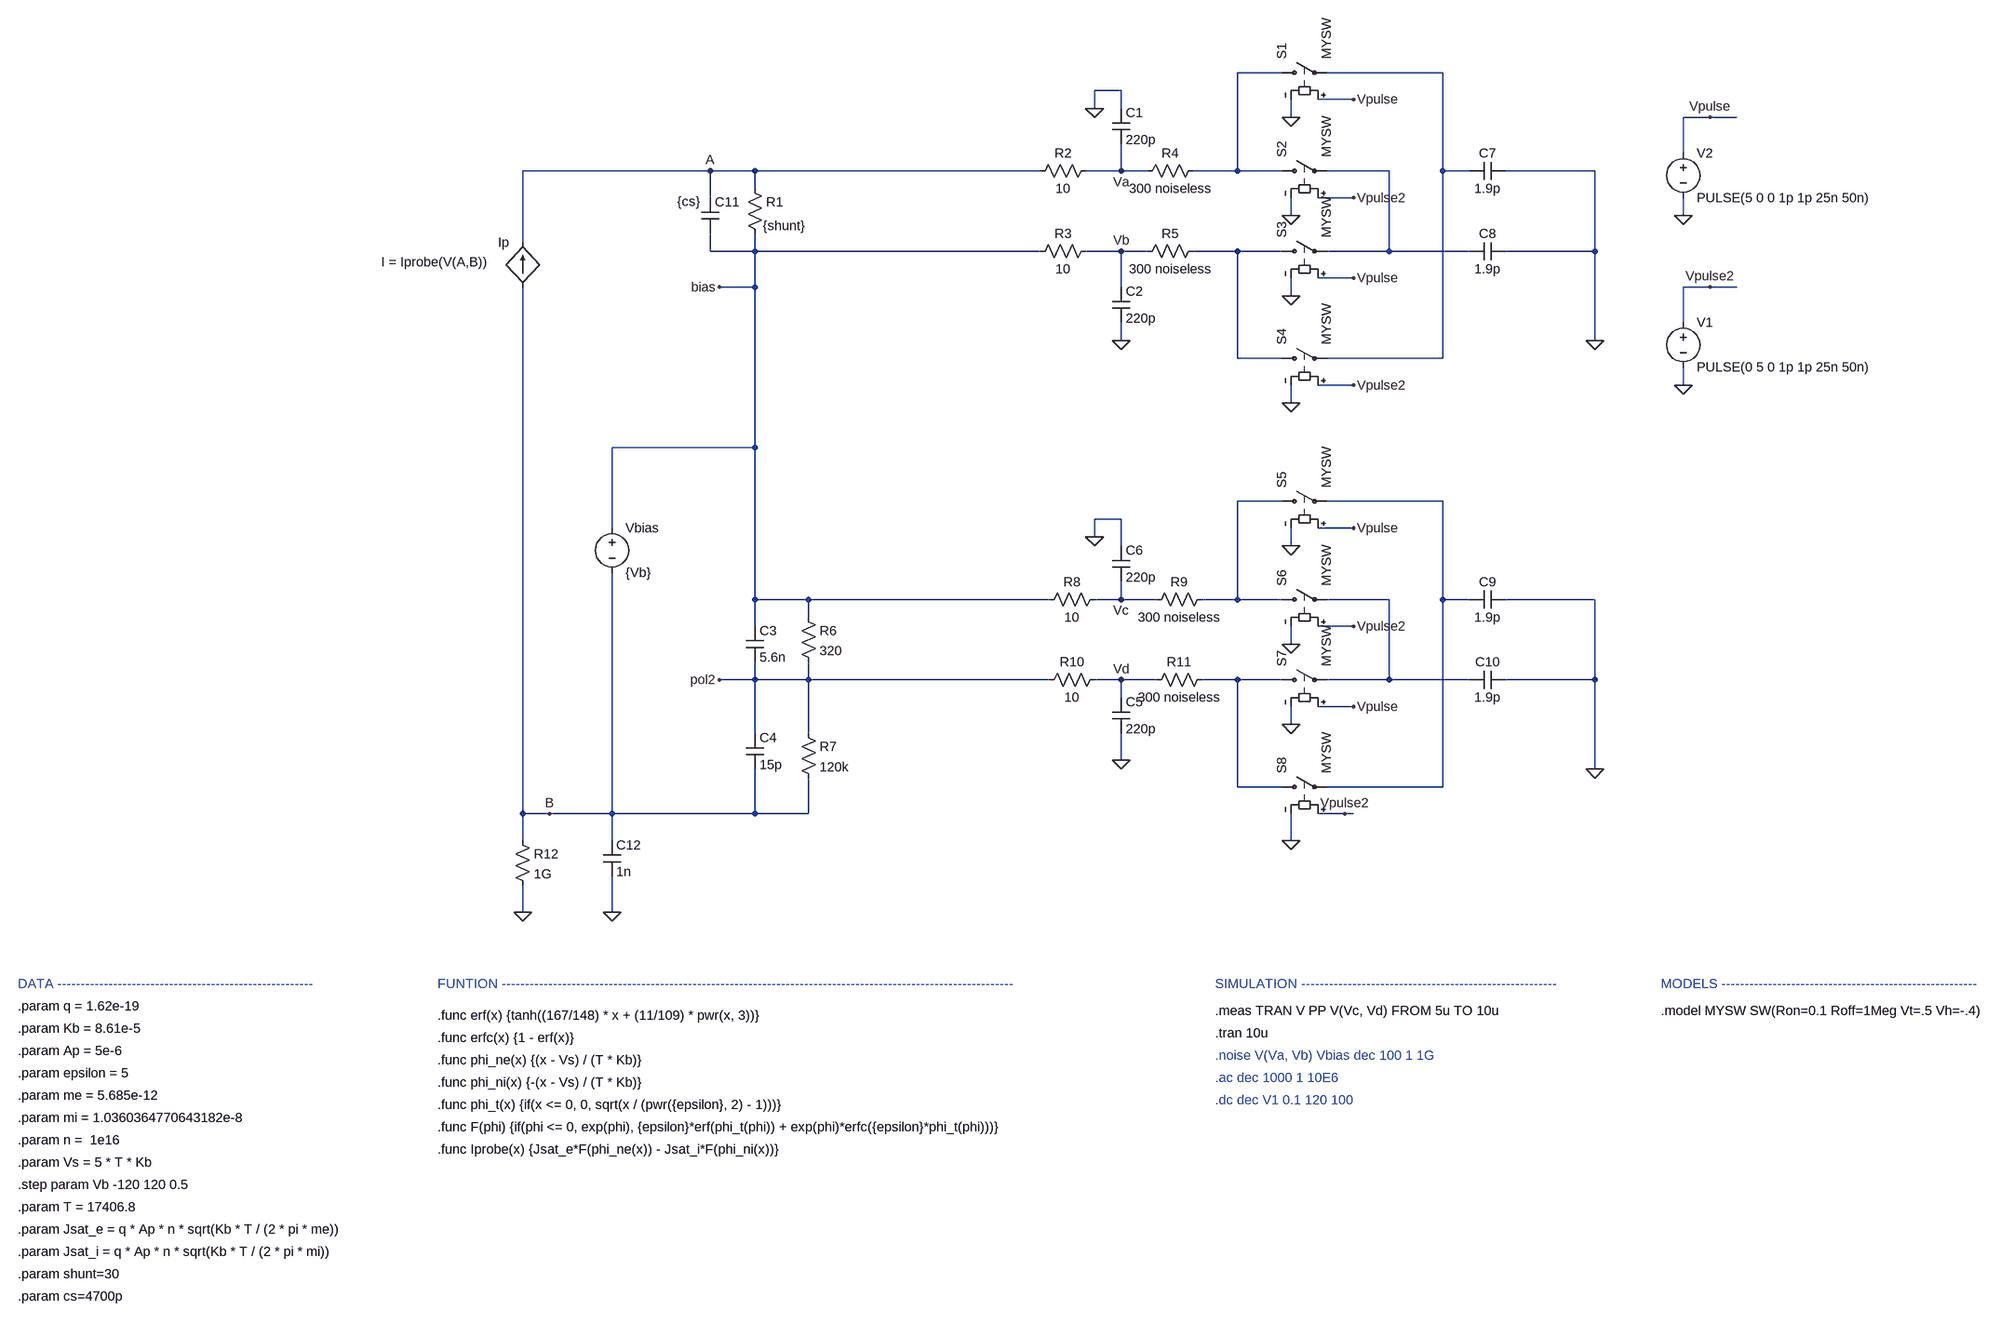
[diagram p0: schematic 3-single_probe.asc]
3-single_probe.asc, the LTspice schematic file:
Version 4.1
SHEET 1 2816 2476
WIRE 864 -304 784 -304
WIRE 1152 -304 944 -304
WIRE 576 -272 528 -272
WIRE 992 -256 928 -256
WIRE 528 -240 528 -272
WIRE 576 -240 576 -272
WIRE 880 -224 880 -256
WIRE 1712 -224 1664 -224
WIRE 1760 -224 1712 -224
WIRE 1664 -160 1664 -224
WIRE -160 -128 -496 -128
WIRE -80 -128 -160 -128
WIRE 432 -128 -80 -128
WIRE 576 -128 576 -176
WIRE 576 -128 512 -128
WIRE 624 -128 576 -128
WIRE 784 -128 784 -304
WIRE 784 -128 704 -128
WIRE 864 -128 784 -128
WIRE 1056 -128 944 -128
WIRE 1152 -128 1152 -304
WIRE 1200 -128 1152 -128
WIRE 1424 -128 1264 -128
WIRE -80 -96 -80 -128
WIRE -160 -80 -160 -128
WIRE 992 -80 928 -80
WIRE 880 -48 880 -80
WIRE 1664 -48 1664 -80
WIRE -496 0 -496 -128
WIRE -160 16 -160 -16
WIRE -80 16 -80 -16
WIRE -80 16 -160 16
WIRE 432 16 -80 16
WIRE 576 16 512 16
WIRE 624 16 576 16
WIRE 784 16 704 16
WIRE 864 16 784 16
WIRE 1056 16 1056 -128
WIRE 1056 16 944 16
WIRE 1200 16 1056 16
WIRE 1424 16 1424 -128
WIRE 1424 16 1264 16
WIRE 992 64 928 64
WIRE -80 80 -80 16
WIRE -80 80 -144 80
WIRE 576 80 576 16
WIRE 1712 80 1664 80
WIRE 1760 80 1712 80
WIRE 880 96 880 64
WIRE 1664 144 1664 80
WIRE 576 176 576 144
WIRE 1424 176 1424 16
WIRE 784 208 784 16
WIRE 864 208 784 208
WIRE 1152 208 1152 -128
WIRE 1152 208 944 208
WIRE 992 256 928 256
WIRE 1664 256 1664 224
WIRE 880 288 880 256
WIRE -80 368 -80 80
WIRE -80 368 -336 368
WIRE 864 464 784 464
WIRE 1152 464 944 464
WIRE 576 496 528 496
WIRE -336 512 -336 368
WIRE 992 512 928 512
WIRE 528 528 528 496
WIRE 576 544 576 496
WIRE 880 544 880 512
WIRE -80 640 -80 368
WIRE 16 640 -80 640
WIRE 448 640 16 640
WIRE 576 640 576 608
WIRE 576 640 528 640
WIRE 640 640 576 640
WIRE 784 640 784 464
WIRE 784 640 720 640
WIRE 864 640 784 640
WIRE 1056 640 944 640
WIRE 1152 640 1152 464
WIRE 1200 640 1152 640
WIRE 1424 640 1264 640
WIRE 16 672 16 640
WIRE -80 688 -80 640
WIRE 992 688 928 688
WIRE 880 720 880 688
WIRE -80 784 -80 752
WIRE -80 784 -144 784
WIRE 16 784 16 752
WIRE 16 784 -80 784
WIRE 448 784 16 784
WIRE 576 784 528 784
WIRE 640 784 576 784
WIRE 784 784 720 784
WIRE 864 784 784 784
WIRE 1056 784 1056 640
WIRE 1056 784 944 784
WIRE 1200 784 1056 784
WIRE 1424 784 1424 640
WIRE 1424 784 1264 784
WIRE 576 816 576 784
WIRE 992 832 928 832
WIRE 880 864 880 832
WIRE -80 880 -80 784
WIRE 16 880 16 784
WIRE 576 928 576 880
WIRE 1424 944 1424 784
WIRE 784 976 784 784
WIRE 864 976 784 976
WIRE 1152 976 1152 640
WIRE 1152 976 944 976
WIRE -496 1024 -496 80
WIRE -448 1024 -496 1024
WIRE -336 1024 -336 592
WIRE -336 1024 -448 1024
WIRE -80 1024 -80 944
WIRE -80 1024 -336 1024
WIRE 16 1024 16 960
WIRE 16 1024 -80 1024
WIRE 976 1024 928 1024
WIRE 992 1024 976 1024
WIRE -496 1072 -496 1024
WIRE -336 1072 -336 1024
WIRE 880 1072 880 1024
WIRE -496 1200 -496 1152
WIRE -336 1200 -336 1136
FLAG 576 176 0
FLAG 528 -240 0
FLAG 576 -128 Va
FLAG 576 16 Vb
FLAG -144 80 bias
FLAG 528 528 0
FLAG 576 928 0
FLAG 576 640 Vc
FLAG 576 784 Vd
FLAG 1424 176 0
FLAG 992 -256 Vpulse
FLAG 992 64 Vpulse
FLAG 880 -224 0
FLAG 880 96 0
FLAG 1424 944 0
FLAG 992 512 Vpulse
FLAG 992 832 Vpulse
FLAG 880 544 0
FLAG 880 864 0
FLAG 880 720 0
FLAG 880 1072 0
FLAG 880 -48 0
FLAG 880 288 0
FLAG 976 1024 Vpulse2
FLAG 992 688 Vpulse2
FLAG 992 -80 Vpulse2
FLAG 992 256 Vpulse2
FLAG 1664 -48 0
FLAG 1664 256 0
FLAG 1712 -224 Vpulse
FLAG 1712 80 Vpulse2
FLAG -144 784 pol2
FLAG -336 1200 0
FLAG -160 -128 A
FLAG -448 1024 B
FLAG -496 1200 0
SYMBOL res -96 -112 R0
WINDOW 3 30 82 Left 2
SYMATTR Value {shunt}
SYMATTR InstName R1
SYMBOL res 528 -144 R90
WINDOW 0 0 56 VBottom 2
WINDOW 3 32 56 VTop 2
SYMATTR InstName R2
SYMATTR Value 10
SYMBOL res 416 32 R270
WINDOW 0 32 56 VTop 2
WINDOW 3 0 56 VBottom 2
SYMATTR InstName R3
SYMATTR Value 10
SYMBOL res 608 -112 R270
WINDOW 0 32 56 VTop 2
WINDOW 3 0 56 VBottom 2
SYMATTR InstName R4
SYMATTR Value 300 noiseless
SYMBOL res 608 32 R270
WINDOW 0 32 56 VTop 2
WINDOW 3 0 56 VBottom 2
SYMATTR InstName R5
SYMATTR Value 300 noiseless
SYMBOL cap 560 -240 R0
SYMATTR InstName C1
SYMATTR Value 220p
SYMBOL cap 560 80 R0
SYMATTR InstName C2
SYMATTR Value 220p
SYMBOL res 0 656 R0
SYMATTR InstName R6
SYMATTR Value 320
SYMBOL res 0 864 R0
SYMATTR InstName R7
SYMATTR Value 120k
SYMBOL cap -96 688 R0
SYMATTR InstName C3
SYMATTR Value 5.6n
SYMBOL cap -96 880 R0
SYMATTR InstName C4
SYMATTR Value 15p
SYMBOL res 544 624 R90
WINDOW 0 0 56 VBottom 2
WINDOW 3 32 56 VTop 2
SYMATTR InstName R8
SYMATTR Value 10
SYMBOL res 736 624 R90
WINDOW 0 0 56 VBottom 2
WINDOW 3 32 56 VTop 2
SYMATTR InstName R9
SYMATTR Value 300 noiseless
SYMBOL res 544 768 R90
WINDOW 0 0 56 VBottom 2
WINDOW 3 32 56 VTop 2
SYMATTR InstName R10
SYMATTR Value 10
SYMBOL res 736 768 R90
WINDOW 0 0 56 VBottom 2
WINDOW 3 32 56 VTop 2
SYMATTR InstName R11
SYMATTR Value 300 noiseless
SYMBOL cap 560 816 R0
SYMATTR InstName C5
SYMATTR Value 220p
SYMBOL cap 560 544 R0
SYMATTR InstName C6
SYMATTR Value 220p
SYMBOL sw 848 -304 R270
SYMATTR InstName S1
SYMATTR Value MYSW
SYMBOL sw 848 -128 R270
SYMATTR InstName S2
SYMATTR Value MYSW
SYMBOL sw 848 16 R270
SYMATTR InstName S3
SYMATTR Value MYSW
SYMBOL sw 848 208 R270
SYMATTR InstName S4
SYMATTR Value MYSW
SYMBOL voltage 1664 128 R0
WINDOW 123 0 0 Left 0
WINDOW 39 0 0 Left 0
SYMATTR InstName V1
SYMATTR Value PULSE(0 5 0 1p 1p 25n 50n)
SYMBOL cap 1264 -144 R90
WINDOW 0 0 32 VBottom 2
WINDOW 3 32 32 VTop 2
SYMATTR InstName C7
SYMATTR Value 1.9p
SYMBOL cap 1264 0 R90
WINDOW 0 0 32 VBottom 2
WINDOW 3 32 32 VTop 2
SYMATTR InstName C8
SYMATTR Value 1.9p
SYMBOL sw 848 464 R270
SYMATTR InstName S5
SYMATTR Value MYSW
SYMBOL sw 848 640 R270
SYMATTR InstName S6
SYMATTR Value MYSW
SYMBOL sw 848 784 R270
SYMATTR InstName S7
SYMATTR Value MYSW
SYMBOL sw 848 976 R270
SYMATTR InstName S8
SYMATTR Value MYSW
SYMBOL cap 1264 624 R90
WINDOW 0 0 32 VBottom 2
WINDOW 3 32 32 VTop 2
SYMATTR InstName C9
SYMATTR Value 1.9p
SYMBOL cap 1264 768 R90
WINDOW 0 0 32 VBottom 2
WINDOW 3 32 32 VTop 2
SYMATTR InstName C10
SYMATTR Value 1.9p
SYMBOL voltage 1664 -176 R0
WINDOW 123 0 0 Left 0
WINDOW 39 0 0 Left 0
SYMATTR InstName V2
SYMATTR Value PULSE(5 0 0 1p 1p 25n 50n)
SYMBOL cap -176 -80 R0
WINDOW 3 -43 7 Left 2
SYMATTR Value {cs}
SYMATTR InstName C11
SYMBOL bi -496 80 R180
WINDOW 0 24 80 Left 2
WINDOW 3 63 45 Left 2
SYMATTR InstName Ip
SYMATTR Value I = Iprobe(V(A,B))
SYMBOL cap -352 1072 R0
SYMATTR InstName C12
SYMATTR Value 1n
SYMBOL voltage -336 496 R0
SYMATTR InstName Vbias
SYMATTR Value {Vb}
SYMBOL res -512 1056 R0
SYMATTR InstName R12
SYMATTR Value 1G
TEXT 744 1672 Left 2 ;.ac dec 1000 1 10E6
TEXT 744 1712 Left 2 ;.dc dec V1 0.1 120 100
TEXT 1624 1552 Left 2 !.model MYSW SW(Ron=0.1 Roff=1Meg Vt=.5 Vh=-.4)
TEXT -1400 2064 Left 2 !.param cs=4700p
TEXT 744 1632 Left 2 ;.noise V(Va, Vb) Vbias dec 100 1 1G
TEXT -1400 2024 Left 2 !.param shunt=30
TEXT 744 1592 Left 2 !.tran 10u
TEXT 744 1552 Left 2 !.meas TRAN V PP V(Vc, Vd) FROM 5u TO 10u
TEXT -648 1760 Left 2 !.func F(phi) {if(phi <= 0, exp(phi), {epsilon}*erf(phi_t(phi)) + exp(phi)*erfc({epsilon}*phi_t(phi)))}
TEXT -648 1560 Left 2 !.func erf(x) {tanh((167/148) * x + (11/109) * pwr(x, 3))}
TEXT -648 1504 Left 2 ;FUNTION --------------------------------------------------------------------------------------------------------------
TEXT 744 1504 Left 2 ;SIMULATION -------------------------------------------------------
TEXT -648 1600 Left 2 !.func erfc(x) {1 - erf(x)}
TEXT -648 1720 Left 2 !.func phi_t(x) {if(x <= 0, 0, sqrt(x / (pwr({epsilon}, 2) - 1)))}
TEXT 1624 1504 Left 2 ;MODELS -------------------------------------------------------
TEXT -1400 1904 Left 2 !.param T = 17406.8
TEXT -1400 1824 Left 2 !.param Vs = 5 * T * Kb
TEXT -1400 1624 Left 2 !.param Ap = 5e-6
TEXT -1400 1664 Left 2 !.param epsilon = 5
TEXT -1400 1704 Left 2 !.param me = 5.685e-12
TEXT -1400 1744 Left 2 !.param mi = 1.0360364770643182e-8
TEXT -1400 1784 Left 2 !.param n =  1e16
TEXT -1400 1944 Left 2 !.param Jsat_e = q * Ap * n * sqrt(Kb * T / (2 * pi * me))
TEXT -1400 1984 Left 2 !.param Jsat_i = q * Ap * n * sqrt(Kb * T / (2 * pi * mi))
TEXT -1400 1504 Left 2 ;DATA -------------------------------------------------------
TEXT -648 1640 Left 2 !.func phi_ne(x) {(x - Vs) / (T * Kb)}
TEXT -1400 1864 Left 2 !.step param Vb -120 120 0.5
TEXT -1400 1544 Left 2 !.param q = 1.62e-19
TEXT -648 1680 Left 2 !.func phi_ni(x) {-(x - Vs) / (T * Kb)}
TEXT -1400 1584 Left 2 !.param Kb = 8.61e-5
TEXT -648 1800 Left 2 !.func Iprobe(x) {Jsat_e*F(phi_ne(x)) - Jsat_i*F(phi_ni(x))}

The netlist it stands for:
* 3-single_probe.asc
R1 A bias {shunt}
R2 Va A 10
R3 bias Vb 10
R4 Va N001 300 noiseless
R5 Vb N004 300 noiseless
C1 0 Va 220p
C2 Vb 0 220p
R6 bias pol2 320
R7 pol2 B 120k
C3 bias pol2 5.6n
C4 pol2 B 15p
R8 Vc bias 10
R9 N005 Vc 300 noiseless
R10 Vd pol2 10
R11 N008 Vd 300 noiseless
C5 Vd 0 220p
C6 0 Vc 220p
S1 N001 N002 Vpulse 0 MYSW
S2 N001 N003 Vpulse2 0 MYSW
S3 N004 N003 Vpulse 0 MYSW
S4 N004 N002 Vpulse2 0 MYSW
V1 Vpulse2 0 PULSE(0 5 0 1p 1p 25n 50n)
C7 0 N002 1.9p
C8 0 N003 1.9p
S5 N005 N006 Vpulse 0 MYSW
S6 N005 N007 Vpulse2 0 MYSW
S7 N008 N007 Vpulse 0 MYSW
S8 N008 N006 Vpulse2 0 MYSW
C9 0 N006 1.9p
C10 0 N007 1.9p
V2 Vpulse 0 PULSE(5 0 0 1p 1p 25n 50n)
C11 A bias {cs}
B§Ip B A I = Iprobe(V(A,B))
C12 B 0 1n
Vbias bias B {Vb}
R12 B 0 1G
* .ac dec 1000 1 10E6
* .dc dec V1 0.1 120 100
.model MYSW SW(Ron=0.1 Roff=1Meg Vt=.5 Vh=-.4)
.param cs=4700p
* .noise V(Va, Vb) Vbias dec 100 1 1G
.param shunt=30
.tran 10u
.meas TRAN V PP V(Vc, Vd) FROM 5u TO 10u
.func F(phi) {if(phi <= 0, exp(phi), {epsilon}*erf(phi_t(phi)) + exp(phi)*erfc({epsilon}*phi_t(phi)))}
.func erf(x) {tanh((167/148) * x + (11/109) * pwr(x, 3))}
* FUNTION --------------------------------------------------------------------------------------------------------------
* SIMULATION -------------------------------------------------------
.func erfc(x) {1 - erf(x)}
.func phi_t(x) {if(x <= 0, 0, sqrt(x / (pwr({epsilon}, 2) - 1)))}
* MODELS -------------------------------------------------------
.param T = 17406.8
.param Vs = 5 * T * Kb
.param Ap = 5e-6
.param epsilon = 5
.param me = 5.685e-12
.param mi = 1.0360364770643182e-8
.param n =  1e16
.param Jsat_e = q * Ap * n * sqrt(Kb * T / (2 * pi * me))
.param Jsat_i = q * Ap * n * sqrt(Kb * T / (2 * pi * mi))
* DATA -------------------------------------------------------
.func phi_ne(x) {(x - Vs) / (T * Kb)}
.step param Vb -120 120 0.5
.param q = 1.62e-19
.func phi_ni(x) {-(x - Vs) / (T * Kb)}
.param Kb = 8.61e-5
.func Iprobe(x) {Jsat_e*F(phi_ne(x)) - Jsat_i*F(phi_ni(x))}
.backanno
.end